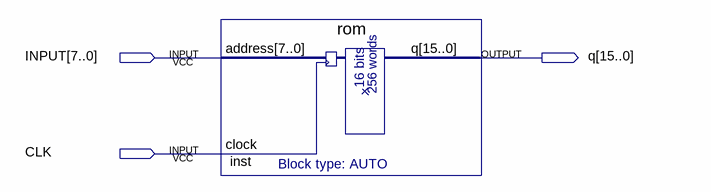
[diagram p0: schematic sheet]
// Quartus schematic ROMcircuit.bdf as structural Verilog: 1 symbols, 3 pins
module ROMcircuit (
  input  [7:0] INPUT,
  input  CLK,
  output [15:0] q
);

  rom inst (.address(INPUT), .clock(CLK), .q(q));
endmodule
